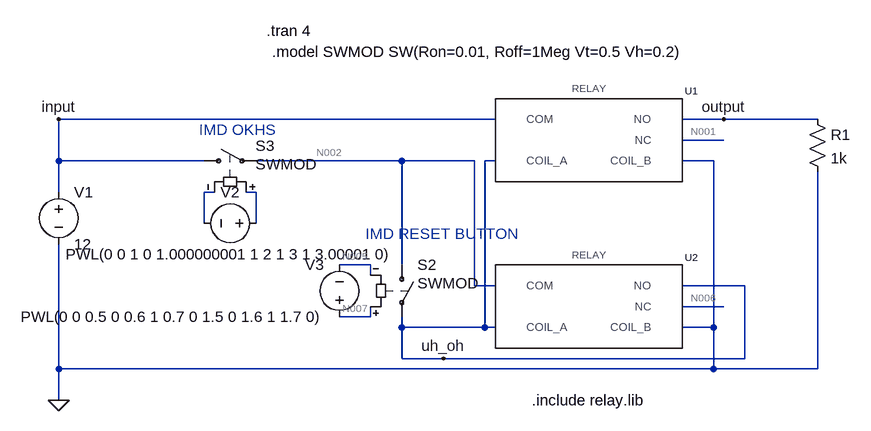
[diagram p0: schematic safety_toggle.asc]
safety_toggle.asc, the LTspice schematic file:
Version 4.1
SHEET 1 1800 740
WIRE -144 -32 -816 -32
WIRE 208 -32 144 -32
WIRE 352 -32 208 -32
WIRE 208 0 144 0
WIRE -816 32 -816 -32
WIRE -592 32 -816 32
WIRE -288 32 -512 32
WIRE -176 32 -288 32
WIRE -144 32 -160 32
WIRE 192 32 144 32
WIRE -816 80 -816 32
WIRE -576 80 -592 80
WIRE -512 80 -528 80
WIRE -592 128 -592 80
WIRE -512 128 -512 80
WIRE -336 192 -384 192
WIRE -288 192 -288 32
WIRE -336 208 -336 192
WIRE -176 224 -176 32
WIRE -144 224 -176 224
WIRE 240 224 144 224
WIRE 208 256 144 256
WIRE -336 272 -336 256
WIRE -336 272 -384 272
WIRE -288 288 -288 272
WIRE -160 288 -160 32
WIRE -160 288 -288 288
WIRE -144 288 -160 288
WIRE 192 288 192 32
WIRE 192 288 144 288
WIRE -288 336 -288 288
WIRE -224 336 -288 336
WIRE 240 336 240 224
WIRE 240 336 -224 336
WIRE -816 352 -816 160
WIRE 192 352 192 288
WIRE 192 352 -816 352
WIRE 352 352 352 48
WIRE 352 352 192 352
WIRE -816 400 -816 352
FLAG -816 400 0
FLAG 208 -32 output
FLAG -816 -32 input
FLAG -224 336 uh_oh
SYMBOL sw -288 176 R0
WINDOW 3 24 44 Left 2
SYMATTR InstName S2
SYMATTR Value SWMOD
SYMBOL voltage -816 64 R0
WINDOW 123 0 0 Left 0
WINDOW 39 0 0 Left 0
SYMATTR InstName V1
SYMATTR Value 12
SYMBOL sw -608 32 R270
WINDOW 0 23 95 VRight 2
WINDOW 3 -5 95 VRight 2
SYMATTR InstName S3
SYMATTR Value SWMOD
SYMBOL voltage -496 128 R90
WINDOW 0 -32 56 VBottom 2
WINDOW 3 32 56 VTop 2
WINDOW 123 0 0 Left 0
WINDOW 39 0 0 Left 0
SYMATTR InstName V2
SYMATTR Value PWL(0 0 1 0 1.000000001 1 2 1 3 1 3.00001 0)
SYMBOL voltage -384 288 R180
WINDOW 0 24 96 Left 2
WINDOW 3 24 16 Left 2
WINDOW 123 0 0 Left 0
WINDOW 39 0 0 Left 0
SYMATTR InstName V3
SYMATTR Value PWL(0 0 0.5 0 0.6 1 0.7 0 1.5 0 1.6 1 1.7 0)
SYMBOL RELAY_SPDT 0 0 R0
SYMATTR InstName U1
SYMBOL RELAY_SPDT 0 256 R0
SYMATTR InstName U2
SYMBOL res 336 -48 R0
SYMATTR InstName R1
SYMATTR Value 1k
TEXT -88 400 Left 2 !.include relay.lib
TEXT -496 -168 Left 2 !.tran 4
TEXT -600 -16 Left 2 ;IMD OKHS
TEXT -344 144 Left 2 ;IMD RESET BUTTON
TEXT -488 -136 Left 2 !.model SWMOD SW(Ron=0.01, Roff=1Meg Vt=0.5 Vh=0.2)

The netlist it stands for:
* safety_toggle.asc
S2 N002 uh_oh N007 N005 SWMOD
V1 input 0 12
S3 input N002 N004 N003 SWMOD
V2 N004 N003 PWL(0 0 1 0 1.000000001 1 2 1 3 1 3.00001 0)
V3 N007 N005 PWL(0 0 0.5 0 0.6 1 0.7 0 1.5 0 1.6 1 1.7 0)
X§U1 uh_oh 0 input output N001 RELAY_SPDT RELAY_SPDT  ; pins COIL_A COIL_B COM NO NC
X§U2 uh_oh 0 N002 uh_oh N006 RELAY_SPDT RELAY_SPDT  ; pins COIL_A COIL_B COM NO NC
R1 output 0 1k
.include relay.lib
.tran 4
* IMD OKHS
* IMD RESET BUTTON
.model SWMOD SW(Ron=0.01, Roff=1Meg Vt=0.5 Vh=0.2)
.backanno
.end

* Results of the author's LTspice run, read from the files saved beside the schematic
* Operating Point, zero values left out:
*   V(uh_oh) = 1.6 mV
*   V(input) = 12 V
*   V(n006) = 4.001 V
*   V(n002) = 4.001 V
*   V(output) = 11.99 mV
*   V(n001) = 12 V
*   I(S3) = -7.999 µA
*   I(S2) = -3.999 µA
*   I(V1) = -19.99 µA
*   I(R1) = 11.99 µA
*   Ix(u2:coil_a) = 3.999 µA
*   Ix(u2:coil_b) = -3.999 µA
*   Ix(u2:com) = 3.999 µA
*   Ix(u2:no) = -3.999 µA
*   Ix(u1:coil_a) = 3.999 µA
*   Ix(u1:coil_b) = -3.999 µA
*   Ix(u1:com) = 11.99 µA
*   Ix(u1:no) = -11.99 µA
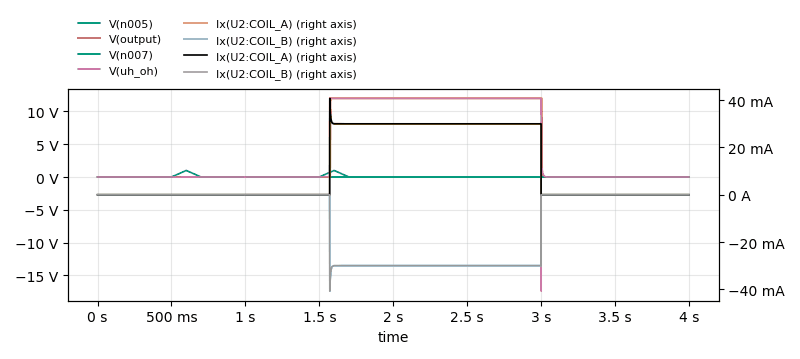
[diagram p1: Transient Analysis of safety_toggle.asc, plotted from the saved traces]
* Transient Analysis, 1 run:
*   V(n005): min 0 V, max 0 V, average 0 V, rms 0 V, last 0 V
*   V(output): min 11.99 mV, max 12 V, average 4.301 V, rms 7.177 V, last 11.99 mV
*   V(n007): min 0 V, max 1 V, average 50 mV, rms 196.8 mV, last 0 V
*   V(uh_oh): min -17.41 V, max 12 V, average 4.295 V, rms 7.173 V, last 1.6 mV
*   Ix(U2:COIL_A): min 3.653 µA, max 40.76 mA, average 10.74 mA, rms 17.96 mA, last 3.999 µA
*   Ix(U2:COIL_B): min -40.76 mA, max -3.653 µA, average -10.74 mA, rms 17.96 mA, last -3.999 µA
*   Ix(U2:COIL_A): min 3.653 µA, max 40.76 mA, average 10.74 mA, rms 17.96 mA, last 3.999 µA
*   Ix(U2:COIL_B): min -40.76 mA, max -3.653 µA, average -10.74 mA, rms 17.96 mA, last -3.999 µA